# Altium schematic sheet Sheet_dual.SchDoc
size A4
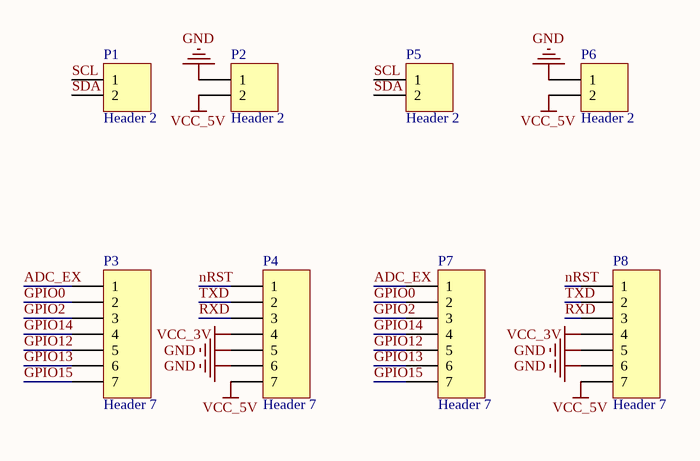
[diagram p0: Sheet_dual.SchDoc]

## Parts
P1  Header 2  [HDR1X2]
P2  Header 2  [HDR1X2]
P3  Header 7  [HDR1X7]
P4  Header 7  [HDR1X7]
P5  Header 2  [HDR1X2]
P6  Header 2  [HDR1X2]
P7  Header 7  [HDR1X7]
P8  Header 7  [HDR1X7]

## Nets
GND: P2.1 P4.5 P4.6 P6.1 P8.5 P8.6
VCC_3V: P4.4 P8.4
VCC_5V: P2.2 P4.7 P6.2 P8.7
ADC_EX: P3.1 P7.1
GPIO0: P3.2 P7.2
GPIO2: P3.3 P7.3
GPIO12: P3.5 P7.5
GPIO13: P3.6 P7.6
GPIO14: P3.4 P7.4
GPIO15: P3.7 P7.7
nRST: P4.1 P8.1
RXD: P4.3 P8.3
SCL: P1.1 P5.1
SDA: P1.2 P5.2
TXD: P4.2 P8.2

## Library data of the parts
P1 P2 P5 P6 = Header 2: Header, 2-Pin; LatestRevisionDate: 17-Jul-2002; LatestRevisionNote: Re-released for DXP Platform.; Publisher: Altium Limited
P3 P4 P7 P8 = Header 7: Header, 7-Pin; LatestRevisionDate: 17-Jul-2002; LatestRevisionNote: Re-released for DXP Platform.; Publisher: Altium Limited